# Altium schematic sheet cinch_stereo_ingang.SchDoc
size A4
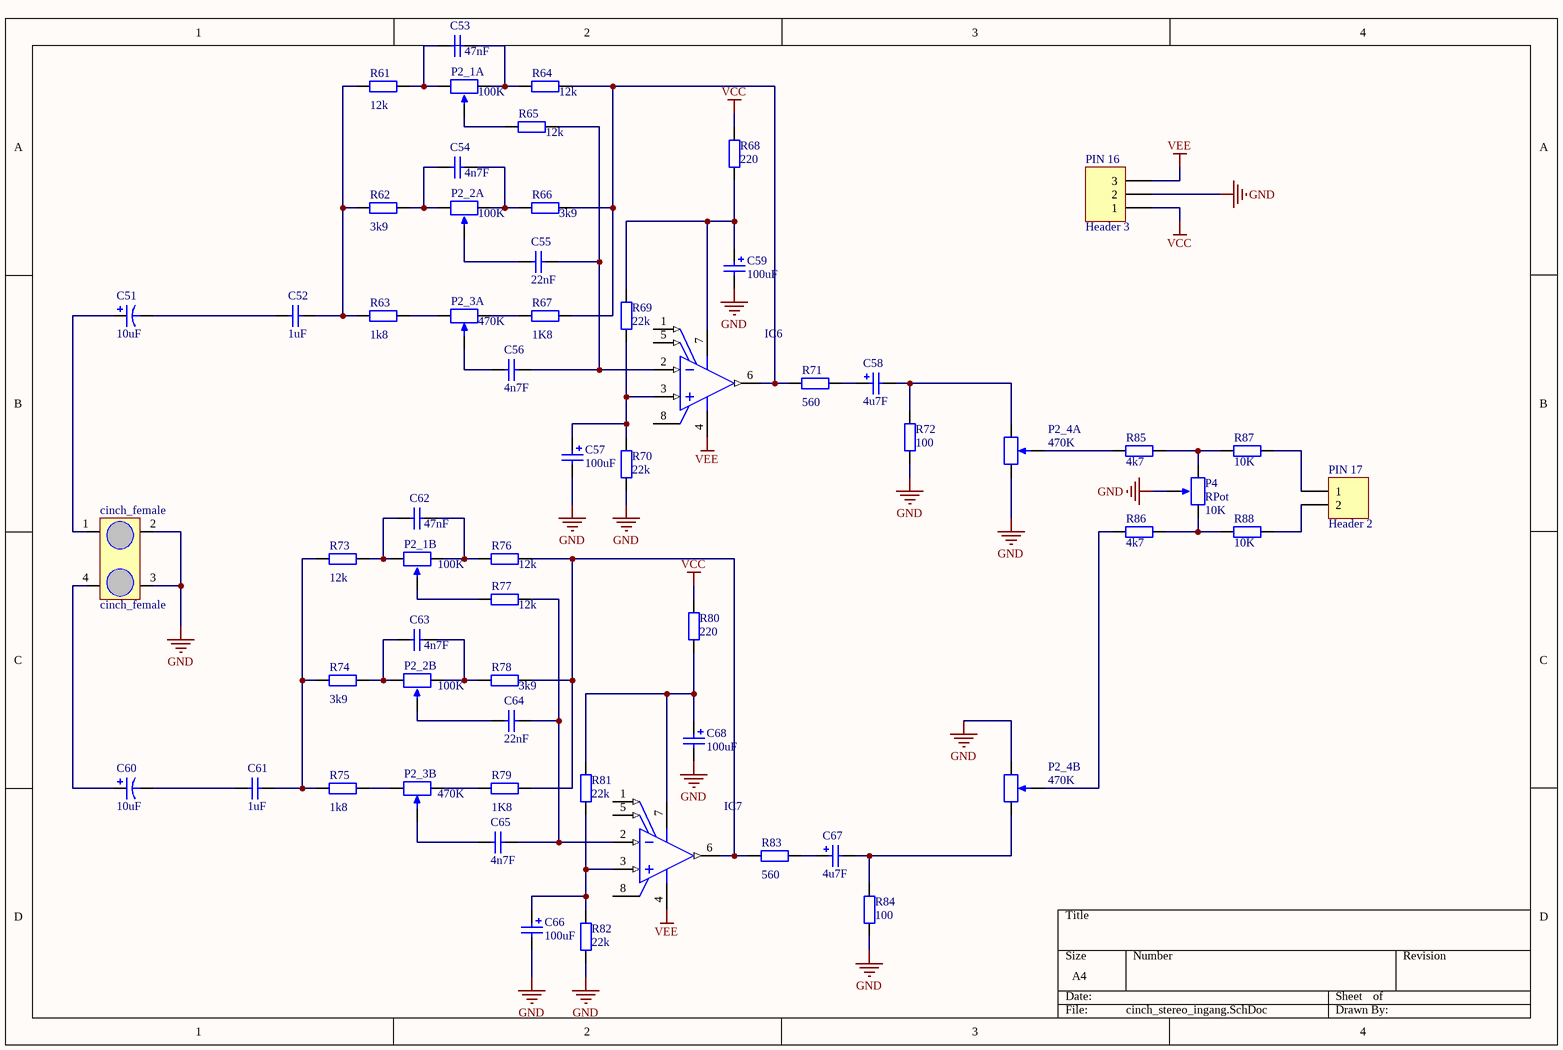
[diagram p0: cinch_stereo_ingang.SchDoc]

## Parts
C51  value 10uF  [Capacitor 10uF]  (hidden comment: Cap Pol2)
C52  value 1uF  [Capacitor 1uF]  (hidden comment: Cap)
C53  value 47nF  [Capacitor 22nF, 47nF, 100nF]  (hidden comment: Cap)
C54  value 4n7F  [Capacitor 22nF, 47nF, 100nF]  (hidden comment: Cap)
C55  value 22nF  [Capacitor 22nF, 47nF, 100nF]  (hidden comment: Cap)
C56  value 4n7F  [Capacitor 22nF, 47nF, 100nF]  (hidden comment: Cap)
C57  value 100uF  [Capacitor 100uF]  (hidden comment: Cap Pol2)
C58  value 4u7F  [Capacitor 4u7F]  (hidden comment: Cap Pol2)
C59  value 100uF  [Capacitor 100uF]  (hidden comment: Cap Pol2)
C60  value 10uF  [Capacitor 10uF]  (hidden comment: Cap Pol2)
C61  value 1uF  [Capacitor 1uF]  (hidden comment: Cap)
C62  value 47nF  [Capacitor 22nF, 47nF, 100nF]  (hidden comment: Cap)
C63  value 4n7F  [Capacitor 22nF, 47nF, 100nF]  (hidden comment: Cap)
C64  value 22nF  [Capacitor 22nF, 47nF, 100nF]  (hidden comment: Cap)
C65  value 4n7F  [Capacitor 22nF, 47nF, 100nF]  (hidden comment: Cap)
C66  value 100uF  [Capacitor 100uF]  (hidden comment: Cap Pol2)
C67  value 4u7F  [Capacitor 4u7F]  (hidden comment: Cap Pol2)
C68  value 100uF  [Capacitor 100uF]  (hidden comment: Cap Pol2)
cinch_female  cinch_female  [header_4]
IC6  TL061CD  [OPAMP_TL061]  (value not drawn)
IC7  TL061CD  [OPAMP_TL061]  (value not drawn)
P2_1A  value 100K  [header_3]  (hidden comment: RPot)
P2_1B  value 100K  [header_3]  (hidden comment: RPot)
P2_2A  value 100K  [header_3]  (hidden comment: RPot)
P2_2B  value 100K  [header_3]  (hidden comment: RPot)
P2_3A  value 470K  [header_3]  (hidden comment: RPot)
P2_3B  value 470K  [header_3]  (hidden comment: RPot)
P2_4A  value 470K  [header_3]  (hidden comment: RPot)
P2_4B  value 470K  [header_3]  (hidden comment: RPot)
P4  RPot  value 10K  [header_3]
PIN_16  Header 3  [header_3]
PIN_17  Header 2  [header_2]
R61  value 12k  [C1206]  (hidden comment: Res2)
R62  value 3k9  [C1206]  (hidden comment: Res2)
R63  value 1k8  [C1206]  (hidden comment: Res2)
R64  value 12k  [C1206]  (hidden comment: Res2)
R65  value 12k  [C1206]  (hidden comment: Res2)
R66  value 3k9  [C1206]  (hidden comment: Res2)
R67  value 1K8  [C1206]  (hidden comment: Res2)
R68  value 220  [C1206]  (hidden comment: Res2)
R69  value 22k  [C1206]  (hidden comment: Res2)
R70  value 22k  [C1206]  (hidden comment: Res2)
R71  value 560  [C1206]  (hidden comment: Res2)
R72  value 100  [C1206]  (hidden comment: Res2)
R73  value 12k  [C1206]  (hidden comment: Res2)
R74  value 3k9  [C1206]  (hidden comment: Res2)
R75  value 1k8  [C1206]  (hidden comment: Res2)
R76  value 12k  [C1206]  (hidden comment: Res2)
R77  value 12k  [C1206]  (hidden comment: Res2)
R78  value 3k9  [C1206]  (hidden comment: Res2)
R79  value 1K8  [C1206]  (hidden comment: Res2)
R80  value 220  [C1206]  (hidden comment: Res2)
R81  value 22k  [C1206]  (hidden comment: Res2)
R82  value 22k  [C1206]  (hidden comment: Res2)
R83  value 560  [C1206]  (hidden comment: Res2)
R84  value 100  [C1206]  (hidden comment: Res2)
R85  value 4k7  [C1206]  (hidden comment: Res2)
R86  value 4k7  [C1206]  (hidden comment: Res2)
R87  value 10K  [C1206]  (hidden comment: Res2)
R88  value 10K  [C1206]  (hidden comment: Res2)

## Nets
GND: C57.2 C59.2 C66.2 C68.2 cinch_female.2(GND_left) cinch_female.3(GND_right) P2_4A.3(TOP) P2_4B.3(BOT) P4.3(TAP) PIN_16.3(2) R70.1 R72.1 R82.1 R84.1
VCC: PIN_16.2(1) R68.2 R80.2
VEE: IC6.4(VCC-) IC7.4(VCC-) PIN_16.1(3)
NetC51_1: C51.1 cinch_female.1(Left_red)
NetC51_2: C51.2 C52.1
NetC52_2: C52.2 R61.1 R62.1 R63.1
NetC53_1: C53.1 P2_1A.1(TOP) R61.2
NetC53_2: C53.2 P2_1A.3(BOT) R64.1
NetC54_1: C54.1 P2_2A.1(TOP) R62.2
NetC54_2: C54.2 P2_2A.3(BOT) R66.1
NetC55_1: C55.1 P2_2A.2(TAP)
NetC55_2: C55.2 C56.2 IC6.2(IN-) R65.2
NetC56_1: C56.1 P2_3A.2(TAP)
NetC57_1: C57.1 IC6.3(IN+) R69.1 R70.2
NetC58_1: C58.1 R71.2
NetC58_2: C58.2 P2_4A.1(BOT) R72.2
NetC59_1: C59.1 IC6.7(VCC+) R68.1 R69.2
NetC60_1: C60.1 cinch_female.4(Right_Black/White)
NetC60_2: C60.2 C61.1
NetC61_2: C61.2 R73.1 R74.1 R75.1
NetC62_1: C62.1 P2_1B.1(TOP) R73.2
NetC62_2: C62.2 P2_1B.3(BOT) R76.1
NetC63_1: C63.1 P2_2B.1(TOP) R74.2
NetC63_2: C63.2 P2_2B.3(BOT) R78.1
NetC64_1: C64.1 P2_2B.2(TAP)
NetC64_2: C64.2 C65.2 IC7.2(IN-) R77.2
NetC65_1: C65.1 P2_3B.2(TAP)
NetC66_1: C66.1 IC7.3(IN+) R81.1 R82.2
NetC67_1: C67.1 R83.2
NetC67_2: C67.2 P2_4B.1(TOP) R84.2
NetC68_1: C68.1 IC7.7(VCC+) R80.1 R81.2
NetIC6_6: IC6.6(OUT) R64.2 R66.2 R67.2 R71.1
NetIC7_6: IC7.6(OUT) R76.2 R78.2 R79.2 R83.1
NetP2_1A_2: P2_1A.2(TAP) R65.1
NetP2_1B_2: P2_1B.2(TAP) R77.1
NetP2_3A_1: P2_3A.1(TOP) R63.2
NetP2_3A_3: P2_3A.3(BOT) R67.1
NetP2_3B_1: P2_3B.1(TOP) R75.2
NetP2_3B_3: P2_3B.3(BOT) R79.1
NetP2_4A_2: P2_4A.2(TAP) R85.1
NetP2_4B_2: P2_4B.2(TAP) R86.1
NetP4_1: P4.1(BOT) R86.2 R88.1
NetP4_2: P4.2(TOP) R85.2 R87.1
NetPIN_17_1: PIN_17.1 R87.2
NetPIN_17_2: PIN_17.2 R88.2

Not connected (* = marked no-connect by the designer): IC6 1(OFFSET_N1) 5(OFFSET_N2) 8(NC); IC7 1(OFFSET_N1) 5(OFFSET_N2) 8(NC)

## Library data of the parts
C51 C57-C60 C66-C68 = Cap Pol2: electrolytic; Published: 8-Jun-2000; LatestRevisionDate: 17-Jul-2002; LatestRevisionNote: Re-released for DXP Platform.; PackageReference: POLAR0.8; Publisher: Altium Limited; PackageDescription: Polarized Capacitor; 2 Leads
C52-C56 C61-C65 = Cap: Capacitor; Published: 8-Jun-2000; LatestRevisionDate: 17-Jul-2002; LatestRevisionNote: Re-released for DXP Platform.; PackageReference: RAD-0.3; Publisher: Altium Limited; PackageDescription: Radial Cap, Thru-Hole; 2 Leads; 0.3 in Pin Spacing
IC6 IC7 = opamp_TL061: Low-Power JFET-Input General-Purpose Operational Amplifier, 7 to 36 V, 0 to 70 degC, 8-pin SOIC (D8), Green (RoHS & no Sb/Br); Manufacturer: Texas Instruments; Sub Family: General Purpose Amplifier, High Supply Voltage Amplifier (>=30V), Low Power Amp (<=500uA); Iq per channel(Max)(mA): 0.25; CMRR(Min)(dB): 70; IIB(Max)(pA): 400; Slew Rate(Typ)(V/us): 3.5; Number of Channels: 1; Total Supply Voltage(Max)(+5V is 5, +/-5V is 10): 36; Vn at 1kHz(Typ)(nV/rtHz): 42; Vio (25C)(Max)(mV): 15; Rating: Military; Offset Drift(Typ)(uV/C): 10; Total Supply Voltage(Min)(+5V is 5, +/-5V is 10): 7; Eco-Plan: Green (RoHS & no Sb/Br); ComponentLink2Description: Datasheet; PackageReference: D0008A; ComponentLink3Description: Package Specification; ComponentLink2URL: http://www.ti.com/lit/ds/symlink/tl061.pdf; Mounting Technology: Surface Mount; ComponentLink1Description: Manufacturer URL; PackageDescription: 8-Pin Plastic Small Outline, Body 4.9 x 3.9 mm, Pitch 1.27 mm; DatasheetVersion: SLOS078J; PartNumber: TL061CD; Code_JEDEC: MS-012; GBW(Typ)(MHz): 1; ComponentLink3URL: http://www.ti.com/litv/pdf/msoi002j; ComponentLink1URL: http://www.ti.com/; PackageVersion: 4040047-3/M, 06/2011
P2_1A P2_1B P2_2A P2_2B P4 = RPot: Potentiometer; Sim Note: Enter the Resistance value and the set point into parameter fields.; Set Position: 0.5; Published: 8-Jun-2000; LatestRevisionDate: 17-Jul-2002; LatestRevisionNote: Re-released for DXP Platform.; PackageReference: VR5; Publisher: Altium Limited; PackageDescription: Variable Resistor, Thru-Hole; 3 Leads
P2_3A P2_3B P2_4A P2_4B = RPot_1: Potentiometer; Sim Note: Enter the Resistance value and the set point into parameter fields.; Set Position: 0.5; Published: 8-Jun-2000; LatestRevisionDate: 17-Jul-2002; LatestRevisionNote: Re-released for DXP Platform.; PackageReference: VR5; Publisher: Altium Limited; PackageDescription: Variable Resistor, Thru-Hole; 3 Leads
PIN_16 = Header 3: Header, 3-Pin; LatestRevisionDate: 17-Jul-2002; LatestRevisionNote: Re-released for DXP Platform.; Publisher: Altium Limited
PIN_17 = Header 2: Header, 2-Pin; LatestRevisionDate: 17-Jul-2002; LatestRevisionNote: Re-released for DXP Platform.; Publisher: Altium Limited
R61-R84 = Res2: Resistor; Published: 8-Jun-2000; LatestRevisionDate: 17-Jul-2002; LatestRevisionNote: Re-released for DXP Platform.; PackageReference: AXIAL-0.4; Publisher: Altium Limited; PackageDescription: Axial Device, Thru-Hole; 2 Leads; 0.4 in Pin Spacing
R85 R86 = Res2_13: Resistor; Published: 8-Jun-2000; LatestRevisionDate: 17-Jul-2002; LatestRevisionNote: Re-released for DXP Platform.; PackageReference: AXIAL-0.4; Publisher: Altium Limited; PackageDescription: Axial Device, Thru-Hole; 2 Leads; 0.4 in Pin Spacing
R87 R88 = Res2_3: Resistor; Published: 8-Jun-2000; LatestRevisionDate: 17-Jul-2002; LatestRevisionNote: Re-released for DXP Platform.; PackageReference: AXIAL-0.4; Publisher: Altium Limited; PackageDescription: Axial Device, Thru-Hole; 2 Leads; 0.4 in Pin Spacing